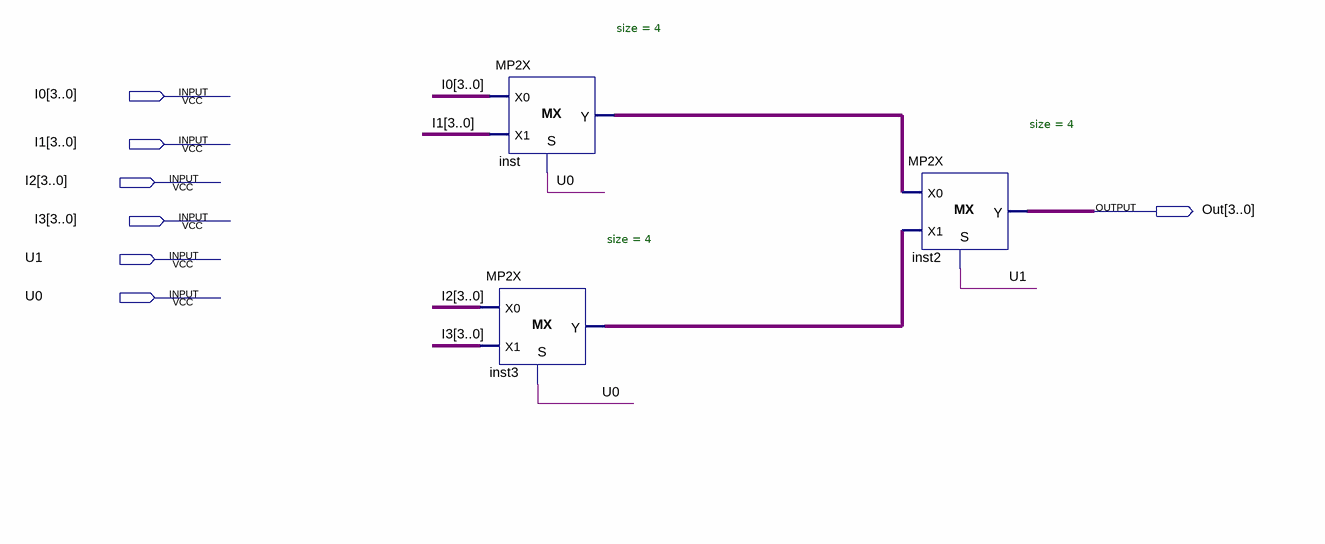
[diagram p0: schematic sheet]
// Quartus schematic DMP4X.bdf as structural Verilog: 3 symbols, 7 pins
module DMP4X (
  input  [3:0] I0,
  input  [3:0] I1,
  input  [3:0] I2,
  input  [3:0] I3,
  input  U1,
  input  U0,
  output [3:0] Out
);

  wire [3:0] inst3_y, inst_y;

  MP2X #(.size(4)) inst (.S(U0), .X0(I0), .X1(I1), .Y(inst_y));
  MP2X #(.size(4)) inst3 (.S(U0), .X0(I2), .X1(I3), .Y(inst3_y));
  MP2X #(.size(4)) inst2 (.S(U1), .X0(inst_y), .X1(inst3_y), .Y(Out));
endmodule
